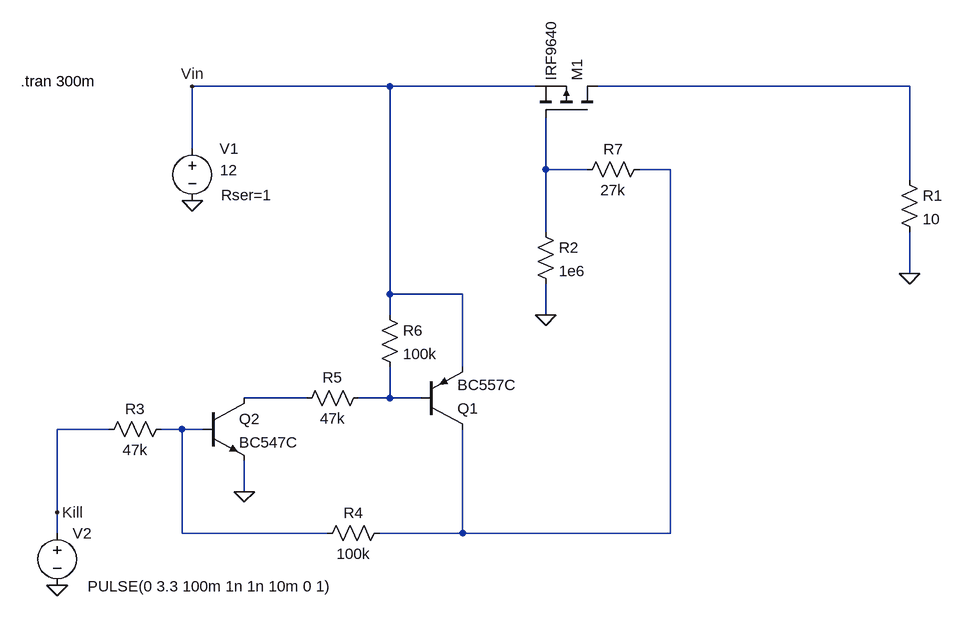
[diagram p0: schematic kill_switch_v1_360ua.asc]
kill_switch_v1_360ua.asc, the LTspice schematic file:
Version 4
SHEET 1 880 692
WIRE -32 -96 -336 -96
WIRE 192 -96 -32 -96
WIRE 768 -96 288 -96
WIRE -336 0 -336 -96
WIRE 208 32 208 -48
WIRE 272 32 208 32
WIRE 400 32 352 32
WIRE 768 48 768 -96
WIRE 208 128 208 32
WIRE 768 192 768 128
WIRE -32 224 -32 -96
WIRE 80 224 -32 224
WIRE -32 256 -32 224
WIRE 208 256 208 208
WIRE 80 336 80 224
WIRE -160 384 -256 384
WIRE -32 384 -32 336
WIRE -32 384 -80 384
WIRE 16 384 -32 384
WIRE -464 432 -544 432
WIRE -352 432 -384 432
WIRE -320 432 -352 432
WIRE -256 528 -256 480
WIRE -544 560 -544 432
WIRE -544 592 -544 560
WIRE -352 592 -352 432
WIRE -128 592 -352 592
WIRE 80 592 80 432
WIRE 80 592 -48 592
WIRE 400 592 400 32
WIRE 400 592 80 592
FLAG -336 80 0
FLAG -336 -96 Vin
FLAG -544 672 0
FLAG -544 560 Kill
FLAG 768 192 0
FLAG 208 256 0
FLAG -256 528 0
SYMBOL voltage -336 -16 R0
WINDOW 3 43 49 Left 2
WINDOW 123 0 0 Left 0
WINDOW 39 44 87 Left 2
WINDOW 0 42 16 Left 2
SYMATTR Value 12
SYMATTR SpiceLine Rser=1
SYMATTR InstName V1
SYMBOL voltage -544 576 R0
WINDOW 123 0 0 Left 0
WINDOW 39 0 0 Left 0
WINDOW 3 47 98 Left 2
SYMATTR InstName V2
SYMATTR Value PULSE(0 3.3 100m 1n 1n 10m 0 1)
SYMBOL res 752 32 R0
SYMATTR InstName R1
SYMATTR Value 10
SYMBOL pmos 288 -48 M270
SYMATTR InstName M1
SYMATTR Value IRF9640
SYMBOL res 192 112 R0
SYMATTR InstName R2
SYMATTR Value 1e6
SYMBOL res -368 416 R90
WINDOW 0 0 56 VBottom 2
WINDOW 3 32 56 VTop 2
SYMATTR InstName R3
SYMATTR Value 47k
SYMBOL res -32 576 R90
WINDOW 0 0 56 VBottom 2
WINDOW 3 32 56 VTop 2
SYMATTR InstName R4
SYMATTR Value 100k
SYMBOL res -64 368 R90
WINDOW 0 0 56 VBottom 2
WINDOW 3 32 56 VTop 2
SYMATTR InstName R5
SYMATTR Value 47k
SYMBOL res -48 240 R0
SYMATTR InstName R6
SYMATTR Value 100k
SYMBOL res 368 16 R90
WINDOW 0 0 56 VBottom 2
WINDOW 3 32 56 VTop 2
SYMATTR InstName R7
SYMATTR Value 27k
SYMBOL pnp 16 432 M180
SYMATTR InstName Q1
SYMATTR Value BC557C
SYMBOL npn -320 384 R0
SYMATTR InstName Q2
SYMATTR Value BC547C
TEXT -600 -104 Left 2 !.tran 300m

The netlist it stands for:
* kill_switch_v1_360ua.asc
V1 Vin 0 12 Rser=1
V2 Kill 0 PULSE(0 3.3 100m 1n 1n 10m 0 1)
R1 N001 0 10
M1 N001 N002 Vin Vin IRF9640
R2 N002 0 1e6
R3 N006 Kill 47k
R4 N003 N006 100k
R5 N005 N004 47k
R6 Vin N005 100k
R7 N003 N002 27k
Q1 N003 N005 Vin 0 BC557C
Q2 N004 N006 0 0 BC547C
.model NPN NPN
.model PNP PNP
.lib standard.bjt
.model NMOS NMOS
.model PMOS PMOS
.lib standard.mos
.tran 300m
.backanno
.end